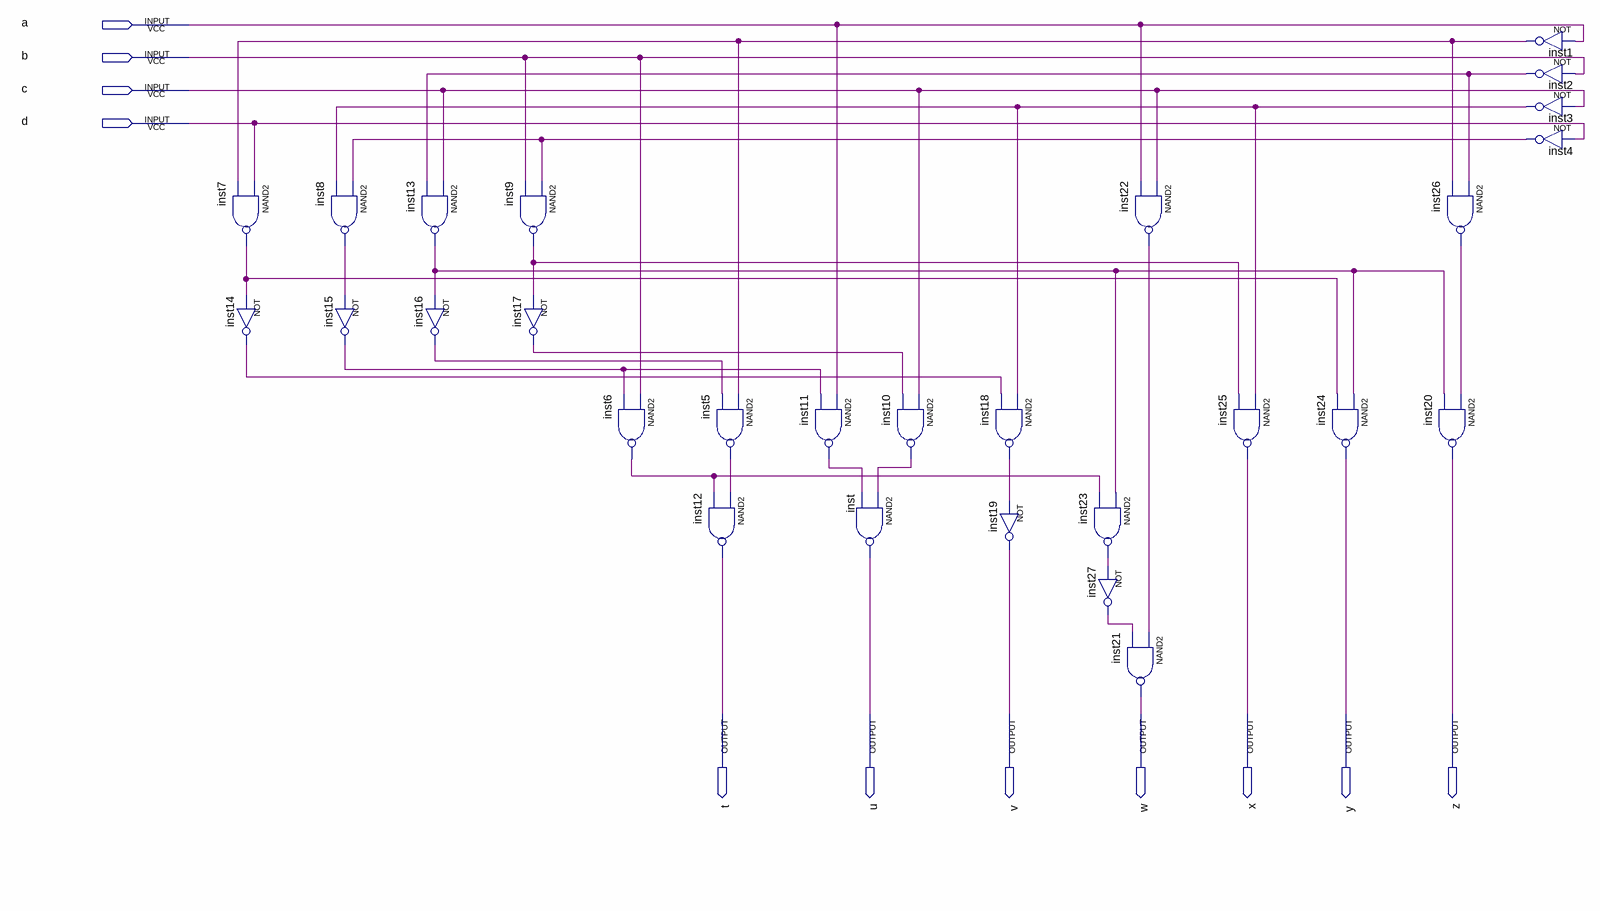
[diagram p0: schematic sheet]
// Quartus schematic SevenSegmentDrivers.bdf as structural Verilog: 28 symbols, 11 pins
module SevenSegmentDrivers (
  input  a,
  input  b,
  input  c,
  input  d,
  output t,
  output u,
  output v,
  output w,
  output x,
  output y,
  output z
);

  wire inst1_out, inst2_out, inst3_out, inst4_out, inst5_out, inst6_out, inst7_out, inst8_out, inst9_out,
       inst10_out, inst11_out, inst13_out, inst14_out, inst15_out, inst16_out, inst17_out, inst18_out,
       inst22_out, inst23_out, inst26_out, inst27_out;

  nand inst7 (inst7_out, d, inst1_out);
  not inst14 (inst14_out, inst7_out);
  nand inst8 (inst8_out, inst4_out, inst3_out);
  not inst15 (inst15_out, inst8_out);
  nand inst13 (inst13_out, c, inst2_out);
  not inst16 (inst16_out, inst13_out);
  nand inst9 (inst9_out, inst4_out, b);
  not inst17 (inst17_out, inst9_out);
  nand inst6 (inst6_out, b, inst15_out);
  nand inst5 (inst5_out, inst1_out, inst16_out);
  nand inst12 (t, inst5_out, inst6_out);
  nand inst11 (inst11_out, a, inst15_out);
  nand inst (u, inst10_out, inst11_out);
  nand inst10 (inst10_out, c, inst17_out);
  nand inst18 (inst18_out, inst3_out, inst14_out);
  not inst19 (v, inst18_out);
  nand inst22 (inst22_out, c, a);
  nand inst23 (inst23_out, inst13_out, inst6_out);
  not inst27 (inst27_out, inst23_out);
  nand inst21 (w, inst22_out, inst27_out);
  nand inst25 (x, inst3_out, inst9_out);
  nand inst24 (y, inst13_out, inst7_out);
  nand inst26 (inst26_out, inst2_out, inst1_out);
  nand inst20 (z, inst26_out, inst13_out);
  not inst1 (inst1_out, a);
  not inst2 (inst2_out, b);
  not inst3 (inst3_out, c);
  not inst4 (inst4_out, d);
endmodule
